# Altium schematic sheet dmx_interface.SchDoc
size A3
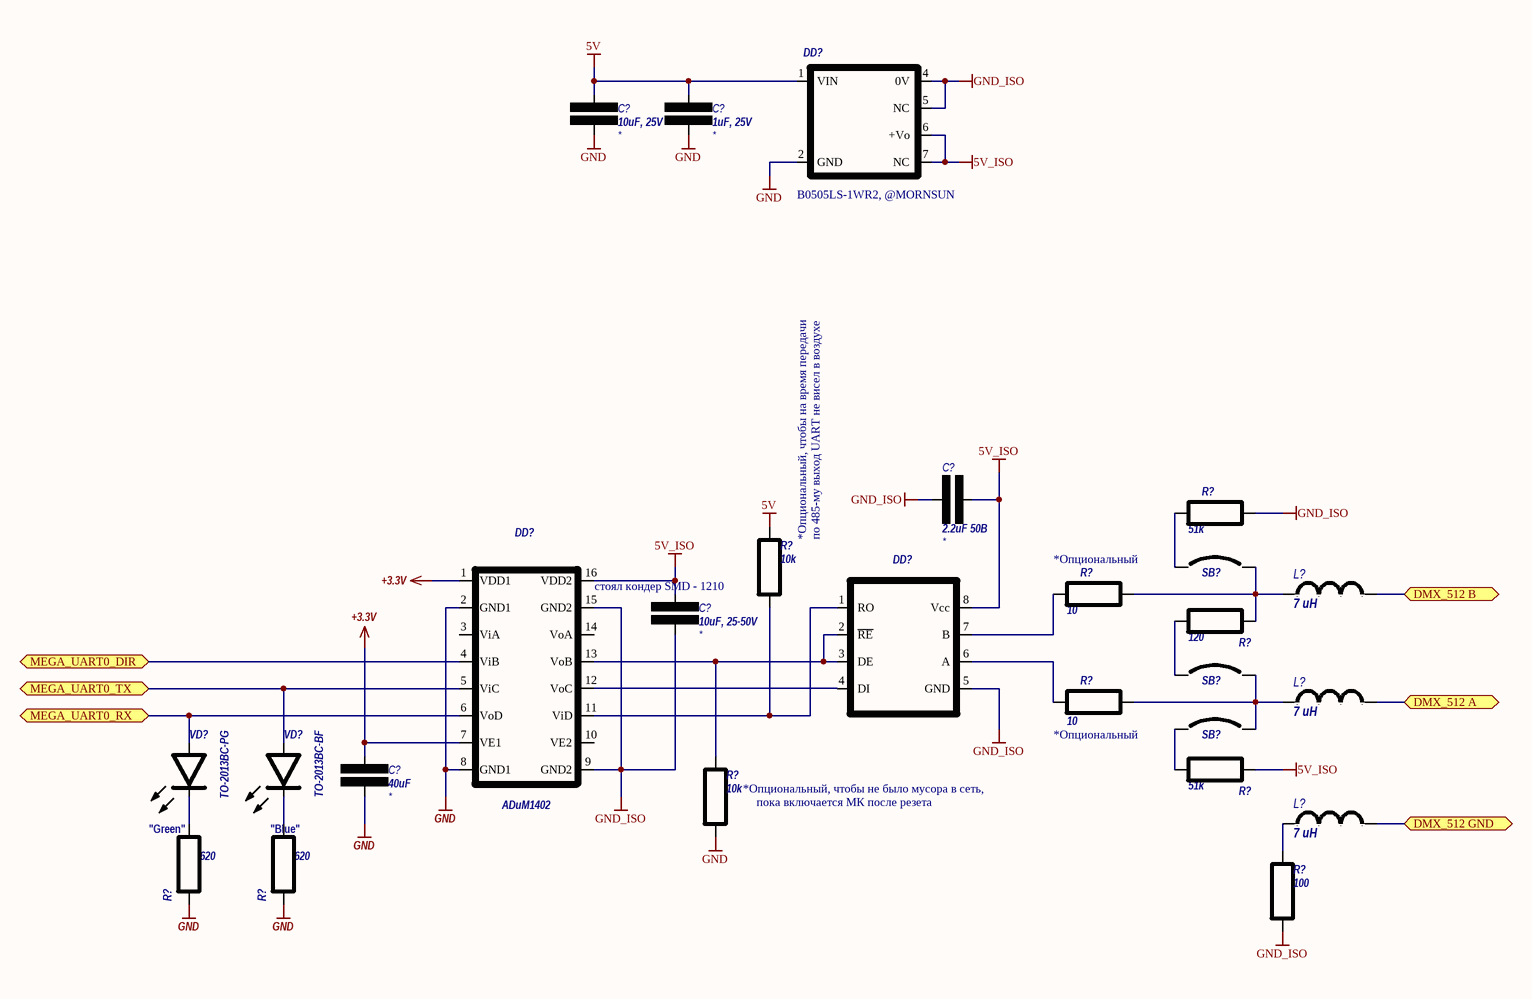
[diagram p0: dmx_interface.SchDoc]

## Parts
(Parts that share a designator on the sheet are numbered #1, #2 ... from top to bottom, then left to right.)
C?#1  10uF, 25V  [C1210]
C?#2  1uF, 25V  [C0805]
C?#3  2.2uF 50В  [C0805]
C?#4  10uF, 25-50V  [C1210]
C?#5  40uF  [C0805]
DD?#1  type: B0505LS-1WR2, @MORNSUN  [0505LS-ISO_POWER]  (hidden comment: B0505LS)
DD?#2  ADuM1402  [SOIC-16W]
DD?#3  ADM485  [DIP8_SMD]  (value not drawn)
L?#1  7 uH  [R0603]
L?#2  7 uH  [R0603]
L?#3  7 uH  [R0603]
R?#1  51k  [R0603]
R?#2  10k  [R0603]
R?#3  10  [R0603]
R?#4  120  [R0603]
R?#5  10  [R0603]
R?#6  51k  [R0603]
R?#7  10k  [R0603]
R?#8  100  [R0603]
R?#9  620  [R0805]
R?#10  620  [R0805]
SB?#1  SB  [SB0603]  (value not drawn)
SB?#2  SB  [SB0603]  (value not drawn)
SB?#3  SB  [SB0603]  (value not drawn)
VD?#1  value TO-2013BC-PG  [led0805]  (hidden comment: LED_0805)
VD?#2  value TO-2013BC-BF  [led0805]  (hidden comment: LED_0805)

## Ports
DMX_512 A, DMX_512 B, DMX_512 GND, MEGA_UART0_DIR, MEGA_UART0_RX, MEGA_UART0_TX

## Nets
5V: C?#1.2 C?#2.2 DD?#1.1(VIN) R?#2.1
5V_ISO: C?#3.2 C?#4.2 DD?#1.6(+Vo) DD?#1.7(NC) DD?#2.16(VDD2) DD?#3.8(Vcc) R?#6.1
+3.3V: C?#5.2 DD?#2.1(VDD1) DD?#2.7(VE1)
GND: C?#1.1 C?#2.1 C?#5.1 DD?#1.2(GND) DD?#2.2(GND1) DD?#2.8(GND1) R?#7.2 R?#9.1 R?#10.1
GND_ISO: C?#3.1 C?#4.1 DD?#1.4(0V) DD?#1.5(NC) DD?#2.9(GND2) DD?#2.15(GND2) DD?#3.5(GND) R?#1.1 R?#8.2
DMX_512 A: L?#2.2 ; port DMX_512 A
DMX_512 B: L?#1.2 ; port DMX_512 B
DMX_512 GND: L?#3.2 ; port DMX_512 GND
MEGA_UART0_DIR: DD?#2.4(ViB) ; port MEGA_UART0_DIR
MEGA_UART0_RX: DD?#2.6(VoD) VD?#1.2(A) ; port MEGA_UART0_RX
MEGA_UART0_TX: DD?#2.5(ViC) VD?#2.2(A) ; port MEGA_UART0_TX
NetDD?#2_11: DD?#2.11(ViD) DD?#3.1(RO) R?#2.2
NetDD?#2_12: DD?#2.12(VoC) DD?#3.4(DI)
NetDD?#2_13: DD?#2.13(VoB) DD?#3.2(~{RE}) DD?#3.3(DE) R?#7.1
NetDD?#3_6: DD?#3.6(A) R?#5.1
NetDD?#3_7: DD?#3.7(B) R?#3.1
NetL?#1_1: L?#1.1 R?#3.2 R?#4.1 SB?#1.2
NetL?#2_1: L?#2.1 R?#5.2 SB?#2.2 SB?#3.2
NetL?#3_1: L?#3.1 R?#8.1
NetR?#1_2: R?#1.2 SB?#1.1
NetR?#4_2: R?#4.2 SB?#2.1
NetR?#6_2: R?#6.2 SB?#3.1
NetR?#9_2: R?#9.2 VD?#1.1(K)
NetR?#10_2: R?#10.2 VD?#2.1(K)

Not connected (* = marked no-connect by the designer): DD?#2 3(ViA) 10(VE2) 14(VoA)

## Notes on the sheet
- (near R?#2) *Опциональный, чтобы на время передачи
- (near R?#2) по 485-му выход UART не висел в воздухе
- стоял кондер SMD - 1210
- (near R?#3) *Опциональный
- (near R?#5) *Опциональный
- (near R?#7) *Опциональный, чтобы не было мусора в сеть,
- (near R?#7) пока включается МК после резета
- "Green"
- (near R?#10) "Blue"

## Library data of the parts
C?#1-C?#5 = Capacitor: fab: *
  C?#1: Value: 10uF, 25V
  C?#2: Value: 1uF, 25V
  C?#3: Value: 2.2uF 50В
  C?#4: Value: 10uF, 25-50V
  C?#5: Value: 40uF
DD?#1 = B0505LS: DC/DC isolated converter 1W 200mA
DD?#2 = ADuM1402: Quad-Channel Digital Isolators; Value: *
L?#1-L?#3 = L: Inductor; Code_IEC: 1005; Published: 8-Jun-2000; LatestRevisionDate: 29-May-2009; LatestRevisionNote: IPC-7351 Footprint Added.; PackageReference: 0402-A; Publisher: Altium Limited; PackageDescription: Chip Inductor; Code_JEITA: 0402; Value: 7 uH
R?#1 R?#3-R?#6 R?#9 R?#10 = Resistor_russian: Resistor
  R?#1 R?#6: Value: 51k
  R?#3 R?#5: Value: 10
  R?#4: Value: 120
  R?#9 R?#10: Value: 620
R?#2 R?#7 R?#8 = R: SMD resistor
  R?#2 R?#7: Value: 10k
  R?#8: Value: 100
DD?#3 = ADM485: Value: *